# Altium schematic sheet ifamp-rx.SchDoc: RX IF Amp
size Letter; CheckedBy: J. Brinton; CompanyName: Signal Laboratories, Inc.; DrawnBy: J. Brinton; Engineer: J. Brinton; Address1: 3479 Edison Way; Address2: Menlo Park CA 94025; Address3: +1 (877) 778-8435; Address4: siglabs.com; Revision: 3; SheetNumber: 12; SheetTotal: 49
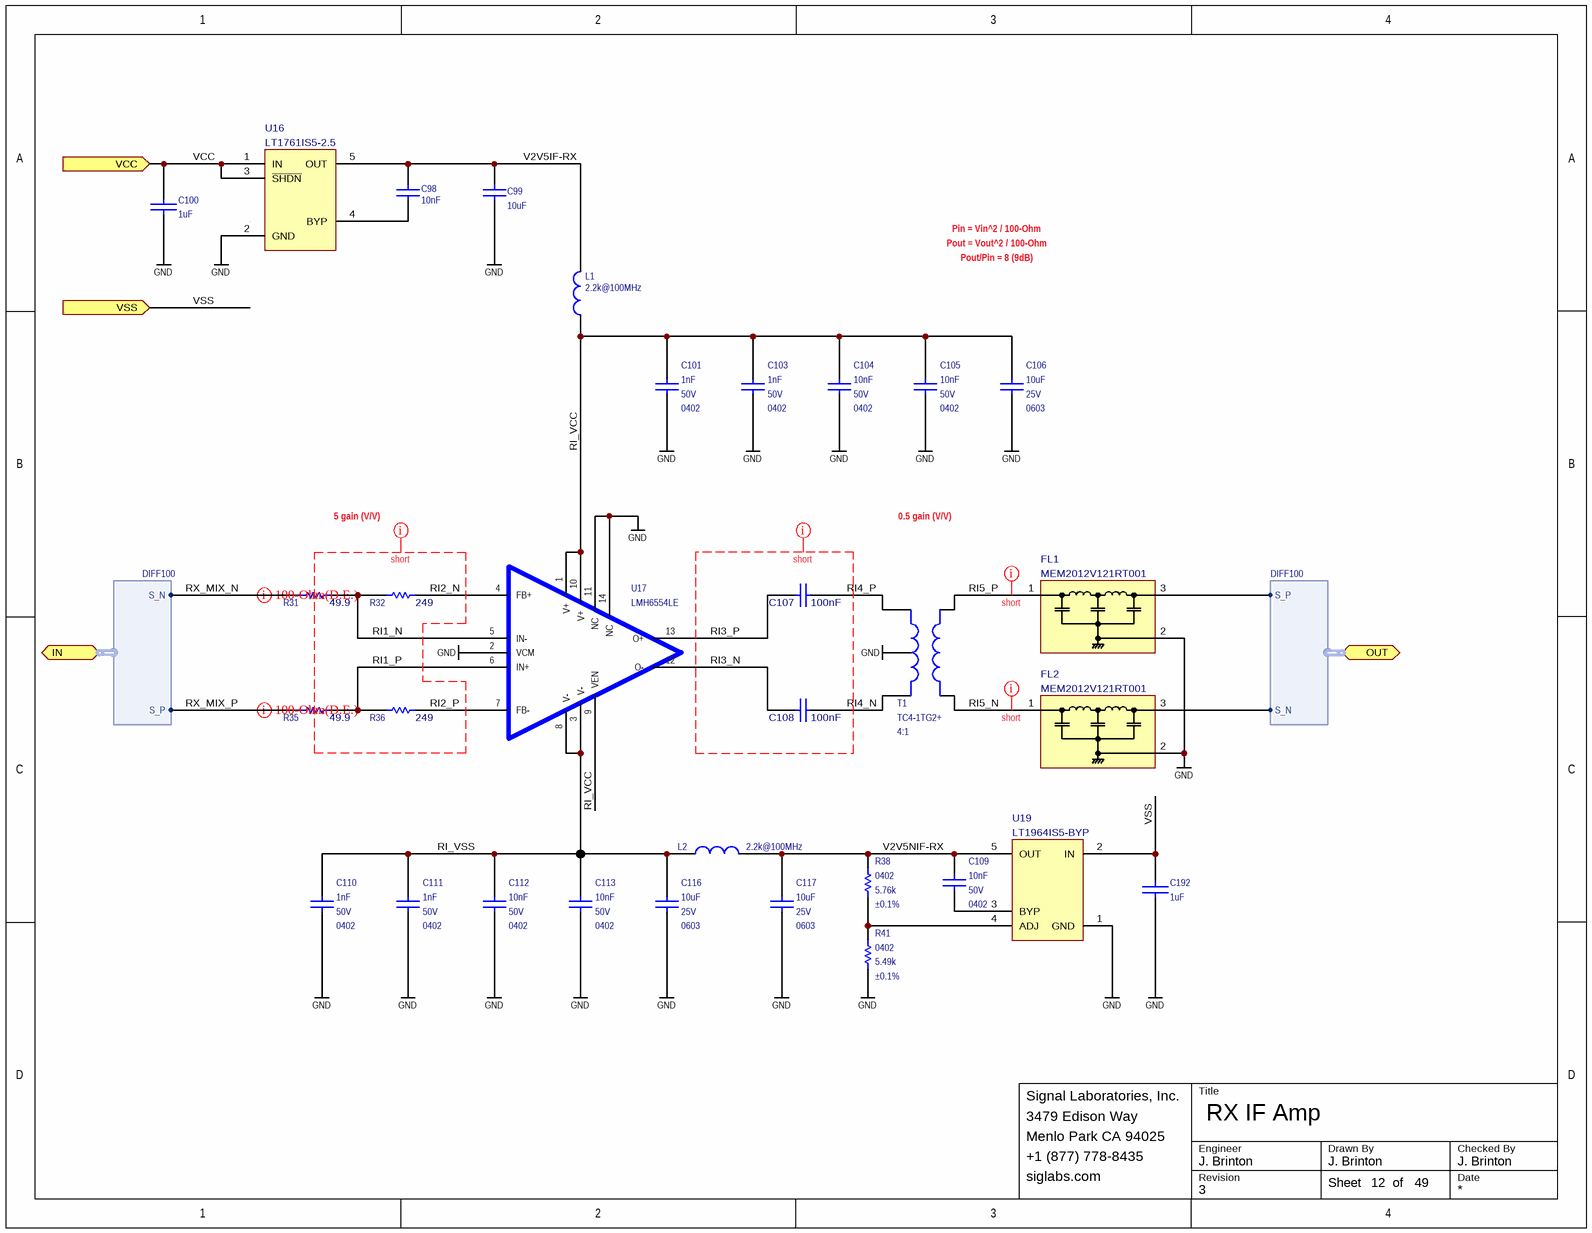
[diagram p0: ifamp-rx.SchDoc]

## Parts
C98  value 10nF  [CAPC100X50X55L25N]  (hidden comment: GRM155R71H103KA88)
C99  value 10uF  [CAPC160X80X90L20N]  (hidden comment: ZRB18AR61E106ME01L)
C100  value 1uF  [CAPC100X50X55L25N]  (hidden comment: GRM155R61A105KE15)
C101  value 1nF  Voltage: 50V  Package: 0402  [CAPC100X50X55L25N]  (hidden comment: CGA2B2NP01H102J050BA)
C103  value 1nF  Voltage: 50V  Package: 0402  [CAPC100X50X55L25N]  (hidden comment: CGA2B2NP01H102J050BA)
C104  value 10nF  Voltage: 50V  Package: 0402  [CAPC100X50X55L25N]  (hidden comment: GRM155R71H103KA88)
C105  value 10nF  Voltage: 50V  Package: 0402  [CAPC100X50X55L25N]  (hidden comment: GRM155R71H103KA88)
C106  value 10uF  Voltage: 25V  Package: 0603  [CAPC160X80X90L20N]  (hidden comment: ZRB18AR61E106ME01L)
C107  value 100nF  [CAPC100X50X55L25N]  (hidden comment: CC0402KRX7R8BB104)
C108  value 100nF  [CAPC100X50X55L25N]  (hidden comment: CC0402KRX7R8BB104)
C109  value 10nF  Voltage: 50V  Package: 0402  [CAPC100X50X55L25N]  (hidden comment: GRM155R71H103KA88)
C110  value 1nF  Voltage: 50V  Package: 0402  [CAPC100X50X55L25N]  (hidden comment: CGA2B2NP01H102J050BA)
C111  value 1nF  Voltage: 50V  Package: 0402  [CAPC100X50X55L25N]  (hidden comment: CGA2B2NP01H102J050BA)
C112  value 10nF  Voltage: 50V  Package: 0402  [CAPC100X50X55L25N]  (hidden comment: GRM155R71H103KA88)
C113  value 10nF  Voltage: 50V  Package: 0402  [CAPC100X50X55L25N]  (hidden comment: GRM155R71H103KA88)
C116  value 10uF  Voltage: 25V  Package: 0603  [CAPC160X80X90L20N]  (hidden comment: ZRB18AR61E106ME01L)
C117  value 10uF  Voltage: 25V  Package: 0603  [CAPC160X80X90L20N]  (hidden comment: ZRB18AR61E106ME01L)
C192  value 1uF  [CAPC100X50X55L25N]  (hidden comment: GRM155R61A105KE15)
FL1  MEM2012V121RT001  [MEM2012V]
FL2  MEM2012V121RT001  [MEM2012V]
L1  value 2.2k@100MHz  [INDC1005X55N]  (hidden comment: MMZ1005A222ET000)
L2  value 2.2k@100MHz  [INDC1005X55N]  (hidden comment: MMZ1005A222ET000)
R31  value 49.9  [RESC1608X55N]  (hidden comment: MCT0603PD4999DP500)
R32  value 249  [RESC1005X40N]  (hidden comment: MCS0402MD2490BE100)
R35  value 49.9  [RESC1608X55N]  (hidden comment: MCT0603PD4999DP500)
R36  value 249  [RESC1005X40N]  (hidden comment: MCS0402MD2490BE100)
R38  value 5.76k  Tolerance: ±0.1%  Package: 0402  [RESC1005X40N]  (hidden comment: RT0402BRE075K76L)
R41  value 5.49k  Tolerance: ±0.1%  Package: 0402  [RESC1005X40N]  (hidden comment: ERA-2AEB5491X)
T1  value 4:1  [AT224-1A]  (hidden comment: TC4-1TG2+)
U16  LT1761IS5-2.5  [TSOT-5]
U17  LMH6554LE  [NHJ0014A]
U19  LT1964IS5-BYP  [SOT23-5]

## Ports
IN (harness DIFF100), OUT (harness DIFF100), VCC (in), VSS (in)

## Harnesses
DIFF100: S_P, S_N

## Nets
GND: C99.1 C100.1 C101.1 C103.1 C104.1 C105.1 C106.1 C110.1 C111.1 C112.1 C113.1 C116.1 C117.1 C192.1 FL1.2(GND) FL2.2(GND) R41.1 T1.2(SecCT) U16.2(GND) U17.2(VCM) U17.11(NC) U17.14(NC) U19.1(GND)
RI1_N: R31.2 R32.1 U17.5(IN-)
RI1_P: R35.2 R36.1 U17.6(IN+)
RI2_N: R32.2 U17.4(FB+)
RI2_P: R36.2 U17.7(FB-)
RI3_N: C108.1 U17.12(O-)
RI3_P: C107.1 U17.13(O+)
RI4_N: C108.2 T1.1(Sec+)
RI4_P: C107.2 T1.3(Sec-)
RI5_N: FL2.1(IN/OUT) T1.6(Pri+)
RI5_P: FL1.1(IN/OUT) T1.4(Pri-)
RI_VCC: C101.2 C103.2 C104.2 C105.2 C106.2 L1.1 U17.1(V+) U17.9(VEN) U17.10(V+)
RI_VSS: C110.2 C111.2 C112.2 C113.2 C116.2 L2.1 U17.3(V-) U17.8(V-)
RX_MIX_N: R31.1 ; port IN.S_N
RX_MIX_P: R35.1 ; port IN.S_P
V2V5IF-RX: C98.2 C99.2 L1.2 U16.5(OUT)
V2V5NIF-RX: C109.2 C117.2 L2.2 R38.2 U19.5(OUT)
VCC: C100.2 U16.1(IN) U16.3(~{SHDN}) ; port VCC
VSS: C192.2 U19.2(IN) ; port VSS
NetC98_1: C98.1 U16.4(BYP)
NetC109_1: C109.1 U19.3(BYP)
NetFL1_3: FL1.3(OUT/IN) ; port OUT.S_P
NetFL2_3: FL2.3(OUT/IN) ; port OUT.S_N
NetR38_1: R38.1 R41.2 U19.4(ADJ)

## Layout directives
net class short: RI1_N, RI1_P, RI2_N, RI2_P, RI3_N, RI3_P, RI4_N, RI4_P, RI5_N, RI5_P
differential pair; net class z100diff12; Name: 100-Ohm(D.E.): RX_MIX_N, RX_MIX_P

## Notes on the sheet
- Pin = Vin^2 / 100-Ohm
- Pout = Vout^2 / 100-Ohm
- Pout/Pin = 8 (9dB)
- 5 gain (V/V)
- 0.5 gain (V/V)
- Title
- Engineer
- Revision
- Drawn By
- Checked By
- Date
- Sheet
- of

## Library data of the parts
C98 C104 C105 C109 C112 C113 = CAP 0402: Ceramic Capacitor 10nF ±10% 50V X7R 0402; Manufacturer: Murata; Tr: -55:125; Manufacturer P/N: GRM155R71H103KA88; Tolerance: ±10%
  C98: Voltage: 50V; Package: 0402
C99 C106 C116 C117 = CAP 0603: Ceramic Capacitor 10uF ±20% 25V X5R 0603; Manufacturer: Murata; Tr: -55:85; Manufacturer P/N: ZRB18AR61E106ME01L; Tolerance: ±20%
  C99: Voltage: 25V; Package: 0603
C100 C192 = CAP: Ceramic Capacitor 1uF ±10% 10V X5R 0402; Manufacturer: Murata; Tr: -55:125; Manufacturer P/N: GRM155R61A105KE15; Package: 0402; Tolerance: ±10%; Voltage: 10V
C101 C103 C110 C111 = CAP 0402: Ceramic Capacitor 1nF ±5% 50V NP0 0402; Manufacturer: TDK; Tr: -55:150; Manufacturer P/N: CGA2B2NP01H102J050BA; Tolerance: ±5%
C107 C108 = TMK105B7104KV: Ceramic Capacitor 100nF ±10% 25V X7R 0402; Manufacturer: Yageo; Manufacturer P/N: TMK105B7104KV; Tolerance: ±10%; Tr: *; Package: 0402; Voltage: 25V
FL1 FL2 = MEM2012V121RT001: MEM2012 Series 120 MHz 10V 100mA SMT Signal Line 3-Terminal Filter; Manufacturer: TDK; Package: MEM2012V; Manufacturer P/N: MEM2012V121RT001
L1 L2 = INDUCTANCE1: Ferrite Bead 2.2k@100MHz 150mA 0402; Manufacturer: TDK; Tr: -55:125; Manufacturer P/N: MMZ1005A222ET000; Package: 0402
R31 R35 = RES 0603: Thin Film Resistor 49.9 Ohm ±0.5% 0603; Manufacturer: Vishay; Tr: -55:155; Package: 0603; Manufacturer P/N: MCT0603PD4999DP500; Do Not Place: *; Tolerance: ±0.5%
R32 R36 = RES 0603: Thin Film Resistor 249 Ohm ±0.1% 0402; Manufacturer: Vishay; Tr: -55:155; Package: 0402; Manufacturer P/N: MCS0402MD2490BE100; Do Not Place: *; Tolerance: ±0.1%
R38 = RES: Thin Film Resistor 5.76k +/-0.1% SMD 0402; Manufacturer: Yageo; Tr: -55:155; Tcr: *; Manufacturer P/N: RT0402BRE075K76L; Alternatives: *; Voltage: *; Power: *
R41 = RES: Thin Film Resistor 5.49k +/-0.1% SMD 0402; Manufacturer: Panasonic; Tr: -55:155; Tcr: *; Manufacturer P/N: ERA-2AEB5491X; Alternatives: *; Voltage: *; Power: *
T1 = TC1-1TG2+: RF Transformer 0.5 to 300MHz SMD; Manufacturer: Mini-Circuits; Manufacturer P/N: TC4-1TG2+
U16 = LT1761IS5-5: 100mA Low Noise LDO 5V; Manufacturer: Linear Technology; Manufacturer P/N: LT1761IS5-5
U17 = LMH6554LE: 2.8 GHz Ultra Linear Fully Differential Amplifier; Manufacturer: Texas Instruments; Manufacturer P/N: LMH6554LE
U19 = LT1964IS5-BYP: 200mA Low Noise negative-LDO; Manufacturer: Linear Technology; Manufacturer P/N: LT1964IS5-BYP